# Altium schematic sheet JOYSTICK + LED.SchDoc: MISKO 3.0
size A4; Date: 19.9.2021; Author: AMADEJ PAPEŽ; SheetNumber: 9; SheetTotal: 13; SheetTitle: JOYSTICK + LED; Version: V1.1
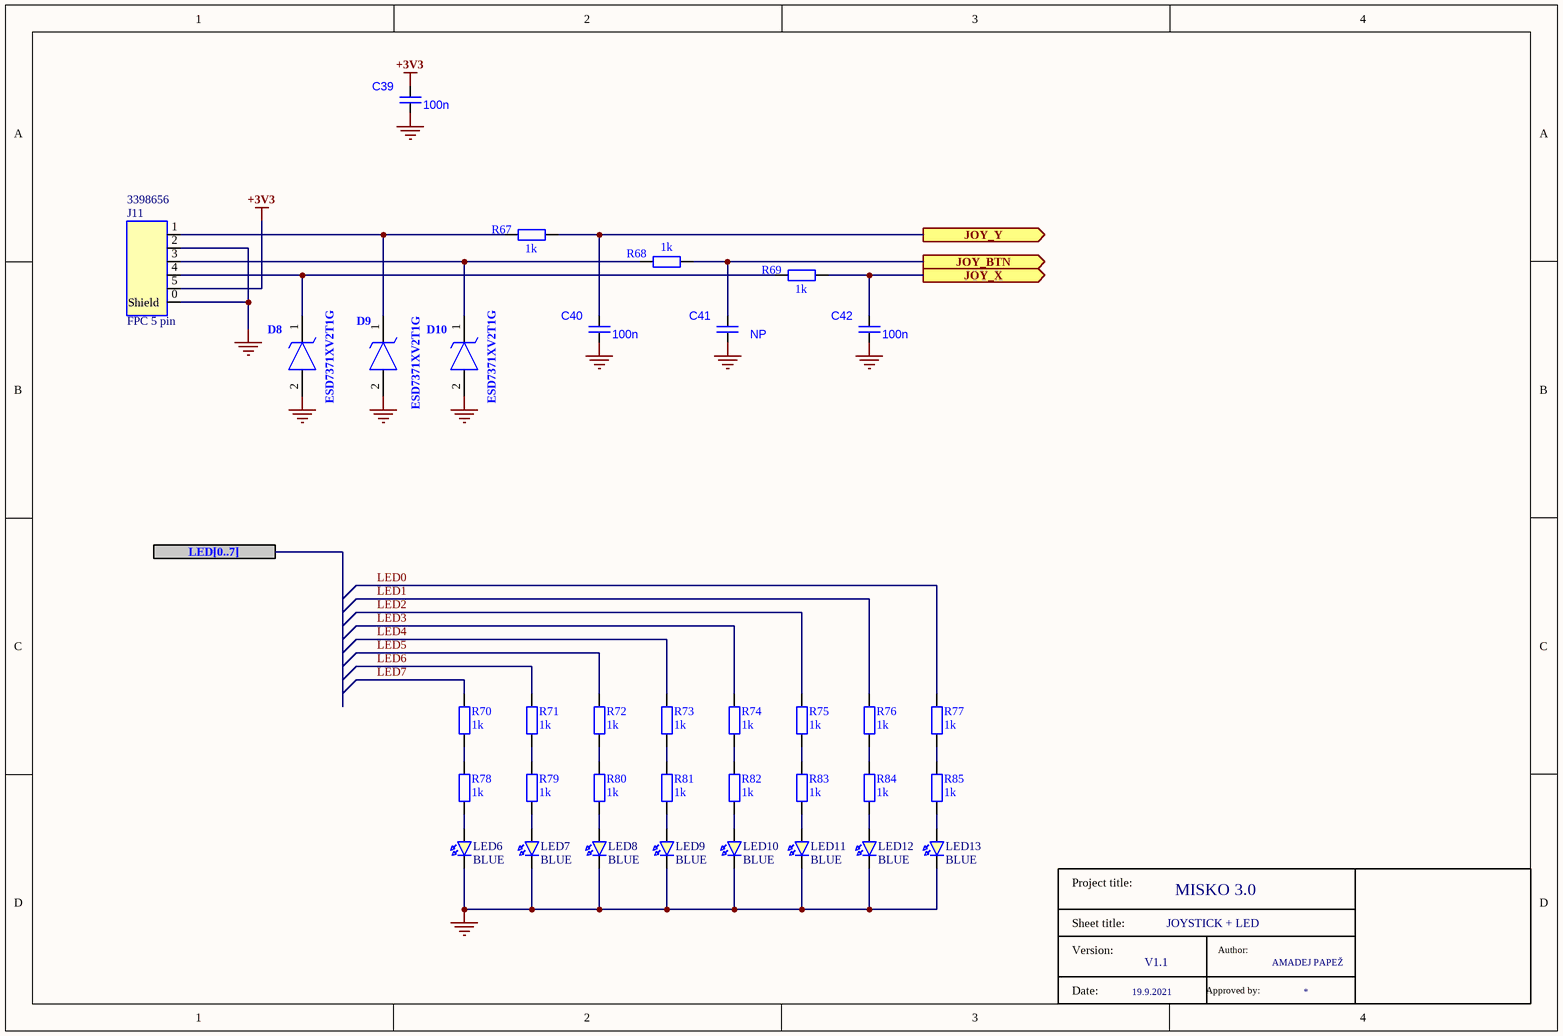
[diagram p0: JOYSTICK + LED.SchDoc]

## Parts
C39  value 100n  [C0603]
C40  value 100n  [C0603]
C41  value NP  [C0603]
C42  value 100n  [C0603]
D8  ESD7371XV2T1G  [SOD1608X70N]
D9  ESD7371XV2T1G  [SOD1608X70N]
D10  ESD7371XV2T1G  [SOD1608X70N]
J11  FPC 5 pin  Supplier Part Number 1: 3398656  [FPC 1734839-5]
LED6  BLUE  [LED1206]
LED7  BLUE  [LED1206]
LED8  BLUE  [LED1206]
LED9  BLUE  [LED1206]
LED10  BLUE  [LED1206]
LED11  BLUE  [LED1206]
LED12  BLUE  [LED1206]
LED13  BLUE  [LED1206]
R67  value 1k  [R1608_0603I_L]
R68  value 1k  [R1608_0603I_L]
R69  value 1k  [R1608_0603I_L]
R70  value 1k  [R1608_0603I_L]
R71  value 1k  [R1608_0603I_L]
R72  value 1k  [R1608_0603I_L]
R73  value 1k  [R1608_0603I_L]
R74  value 1k  [R1608_0603I_L]
R75  value 1k  [R1608_0603I_L]
R76  value 1k  [R1608_0603I_L]
R77  value 1k  [R1608_0603I_L]
R78  value 1k  [R1608_0603I_L]
R79  value 1k  [R1608_0603I_L]
R80  value 1k  [R1608_0603I_L]
R81  value 1k  [R1608_0603I_L]
R82  value 1k  [R1608_0603I_L]
R83  value 1k  [R1608_0603I_L]
R84  value 1k  [R1608_0603I_L]
R85  value 1k  [R1608_0603I_L]
T9  (no value)

## Ports
JOY_BTN (out), JOY_X (out), JOY_Y (out), LED[0..7] (harness LED_BUS)

## Nets
+3V3: C39.2 J11.5
GND: C39.1 C40.1 C41.1 C42.1 D8.2(A) D9.2(A) D10.2(A) J11.0(Shield) J11.2 LED6.1(KATODE) LED7.1(KATODE) LED8.1(KATODE) LED9.1(KATODE) LED10.1(KATODE) LED11.1(KATODE) LED12.1(KATODE) LED13.1(KATODE)
JOY_BTN: C41.2 R68.1 ; port JOY_BTN
JOY_X: C42.2 R69.1 ; port JOY_X
JOY_Y: C40.2 R67.1 ; port JOY_Y
LED0: R77.2
LED1: R76.2
LED2: R75.2
LED3: R74.2
LED4: R73.2
LED5: R72.2
LED6: R71.2
LED7: R70.2
NetD8_1: D8.1(K) J11.4 R69.2
NetD9_1: D9.1(K) J11.1 R67.2
NetD10_1: D10.1(K) J11.3 R68.2
NetLED6_2: LED6.2(ANODE) R78.1
NetLED7_2: LED7.2(ANODE) R79.1
NetLED8_2: LED8.2(ANODE) R80.1
NetLED9_2: LED9.2(ANODE) R81.1
NetLED10_2: LED10.2(ANODE) R82.1
NetLED11_2: LED11.2(ANODE) R83.1
NetLED12_2: LED12.2(ANODE) R84.1
NetLED13_2: LED13.2(ANODE) R85.1
NetR70_1: R70.1 R78.2
NetR71_1: R71.1 R79.2
NetR72_1: R72.1 R80.2
NetR73_1: R73.1 R81.2
NetR74_1: R74.1 R82.2
NetR75_1: R75.1 R83.2
NetR76_1: R76.1 R84.2
NetR77_1: R77.1 R85.2

## Notes on the sheet
- (in symbol Title block) Project title:; Sheet title:; Version:; Author:; Date:; Approved by:

## Library data of the parts
C39-C42 = C: Capacitor; Code: NB6-100N
D8-D10 = ESD7371XV2T1G: TVS Diode (Uni-directional); Manufacturer_Name: ON Semiconductor; Code: KD-ESD7371X; Datasheet Link: http://www.onsemi.com/pub/Collateral/ESD7371-D.PDF; Height: 0.7mm; Manufacturer_Part_Number: ESD7371XV2T1G; Mouser Part Number: 863-ESD7371XV2T1G; Mouser Price/Stock: https://www.mouser.co.uk/ProductDetail/ON-Semiconductor/ESD7371XV2T1G?qs=dbuNSGnowt2%2F4vd%2Frk8Hiw%3D%3D; Arrow Part Number: ESD7371XV2T1G; Arrow Price/Stock: https://www.arrow.com/en/products/esd7371xv2t1g/on-semiconductor
J11 = FPC 1734839-5: TE connectivity  FPC 5 pin 0.5 mm ZIF top contact female connector 1734839-5; Supplier 1: Farnell
LED6-LED13 = LED: Code: KLB-B
R67-R85 = R: Code: LC4-1K
T9 = Title block